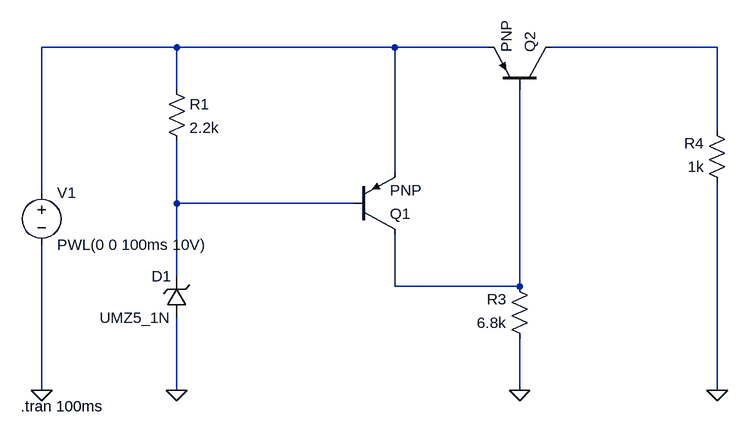
[diagram p0: schematic Overvoltage-Protection-PNP.asc]
Overvoltage-Protection-PNP.asc, the LTspice schematic file:
Version 4
SHEET 1 932 680
WIRE 80 -80 -128 -80
WIRE 416 -80 80 -80
WIRE 560 -80 416 -80
WIRE 912 -80 656 -80
WIRE 80 -16 80 -80
WIRE 912 48 912 -80
WIRE 416 112 416 -80
WIRE -128 144 -128 -80
WIRE 80 160 80 64
WIRE 352 160 80 160
WIRE 80 272 80 160
WIRE 416 288 416 208
WIRE 608 288 608 -16
WIRE 608 288 416 288
WIRE -128 448 -128 224
WIRE 80 448 80 336
WIRE 608 448 608 368
WIRE 912 448 912 128
FLAG -128 448 0
FLAG 80 448 0
FLAG 608 448 0
FLAG 912 448 0
SYMBOL voltage -128 128 R0
WINDOW 123 0 0 Left 0
WINDOW 39 0 0 Left 0
SYMATTR InstName V1
SYMATTR Value PWL(0 0 100ms 10V)
SYMBOL res 64 -32 R0
SYMATTR InstName R1
SYMATTR Value 2.2k
SYMBOL zener 96 336 R180
WINDOW 0 24 64 Left 2
WINDOW 3 24 0 Left 2
SYMATTR InstName D1
SYMATTR Value UMZ5_1N
SYMBOL pnp 352 208 M180
SYMATTR InstName Q1
SYMBOL pnp 656 -16 M270
SYMATTR InstName Q2
SYMBOL res 624 384 R180
WINDOW 0 36 76 Left 2
WINDOW 3 36 40 Left 2
SYMATTR InstName R3
SYMATTR Value 6.8k
SYMBOL res 928 144 R180
WINDOW 0 36 76 Left 2
WINDOW 3 36 40 Left 2
SYMATTR InstName R4
SYMATTR Value 1k
TEXT -160 472 Left 2 !.tran 100ms

The netlist it stands for:
* Overvoltage-Protection-PNP.asc
V1 N001 0 PWL(0 0 100ms 10V)
R1 N001 N003 2.2k
D1 0 N003 UMZ5_1N
Q1 N004 N003 N001 0 PNP
Q2 N002 N004 N001 0 PNP
R3 0 N004 6.8k
R4 0 N002 1k
.model D D
.lib standard.dio
.model NPN NPN
.model PNP PNP
.lib standard.bjt
.tran 100ms
.backanno
.end